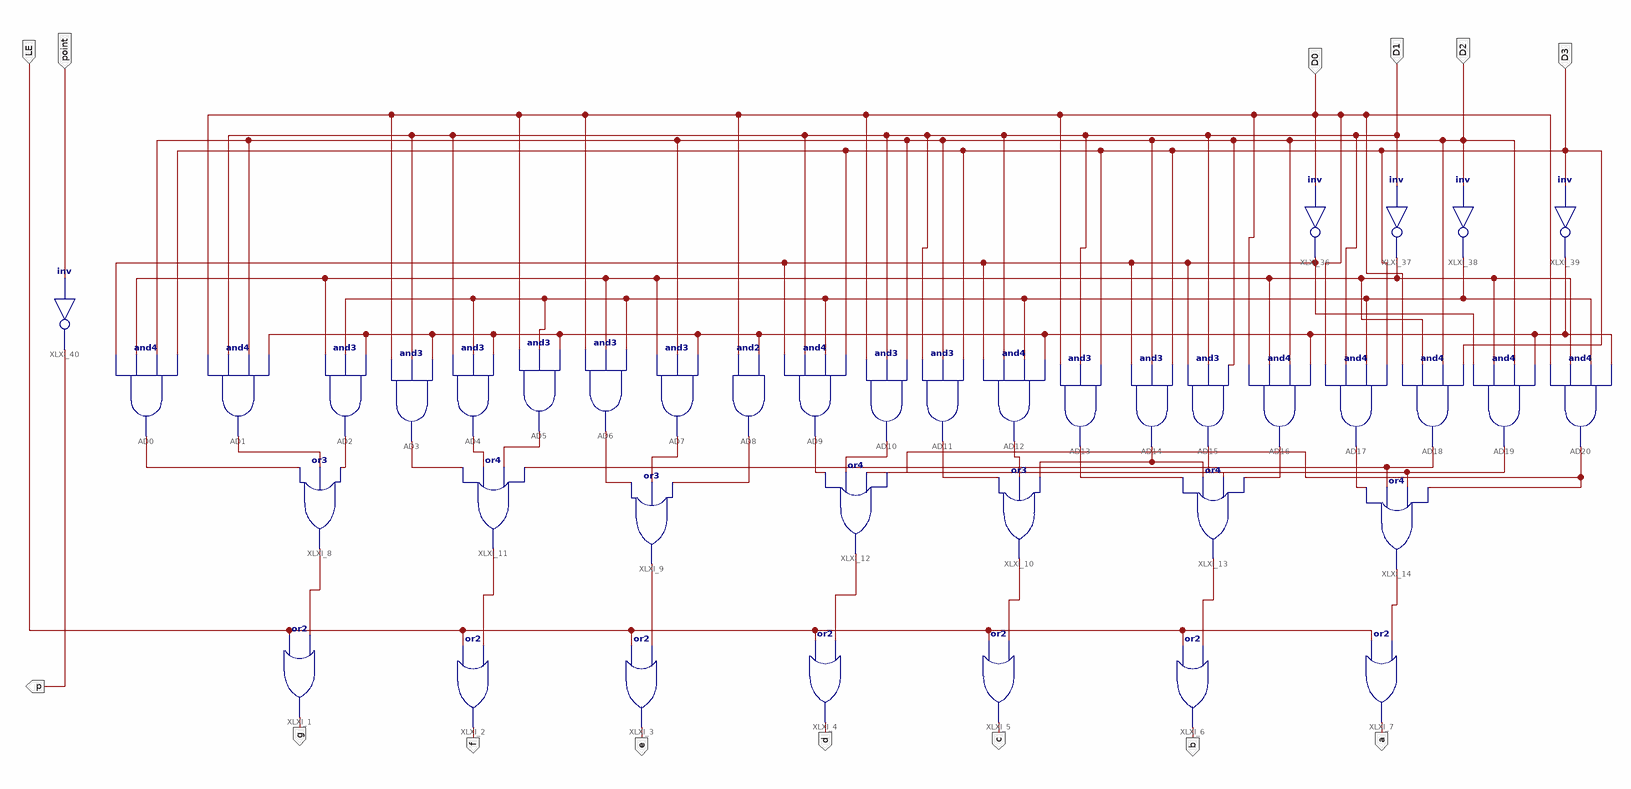
[diagram p0: schematic sheet 1]
// Xilinx ISE schematic MC14495_ZJU.sch (kintex7) as structural Verilog: 40 symbols, 14 ports
module MC14495_ZJU (
  input  D3,
  input  D0,
  input  D1,
  input  D2,
  input  LE,
  input  point,
  output p,
  output g,
  output f,
  output e,
  output d,
  output c,
  output b,
  output a
);

  wire XLXN_12, XLXN_17, XLXN_22, XLXN_25, XLXN_27, XLXN_28, XLXN_29, XLXN_30, XLXN_31, XLXN_32, XLXN_33,
       XLXN_34, XLXN_35, XLXN_36, XLXN_37, XLXN_38, XLXN_39, XLXN_40, XLXN_41, XLXN_42, XLXN_43, XLXN_45,
       XLXN_46, XLXN_47, XLXN_50, XLXN_51, XLXN_52, XLXN_53, XLXN_54, XLXN_55, XLXN_56, XLXN_57;

  or XLXI_1 (g, LE, XLXN_30);
  or XLXI_2 (f, LE, XLXN_52);
  or XLXI_3 (e, LE, XLXN_53);
  or XLXI_4 (d, LE, XLXN_54);
  or XLXI_5 (c, LE, XLXN_55);
  or XLXI_6 (b, LE, XLXN_56);
  or XLXI_7 (a, LE, XLXN_57);
  or XLXI_8 (XLXN_30, XLXN_27, XLXN_28, XLXN_29);
  or XLXI_9 (XLXN_53, XLXN_34, XLXN_35, XLXN_36);
  or XLXI_10 (XLXN_55, XLXN_39, XLXN_40, XLXN_42);
  or XLXI_11 (XLXN_52, XLXN_31, XLXN_32, XLXN_33, XLXN_47);
  or XLXI_12 (XLXN_54, XLXN_37, XLXN_38, XLXN_50, XLXN_51);
  or XLXI_13 (XLXN_56, XLXN_41, XLXN_42, XLXN_43, XLXN_45);
  or XLXI_14 (XLXN_57, XLXN_46, XLXN_47, XLXN_50, XLXN_51);
  and AD0 (XLXN_27, XLXN_12, XLXN_17, D2, D3);
  and AD1 (XLXN_28, D0, D1, D2, XLXN_25);
  and AD2 (XLXN_29, XLXN_17, XLXN_22, XLXN_25);
  and AD3 (XLXN_31, D0, D1, XLXN_25);
  and AD4 (XLXN_32, D1, XLXN_22, XLXN_25);
  and AD5 (XLXN_33, D0, XLXN_22, XLXN_25);
  and AD6 (XLXN_34, D0, XLXN_17, XLXN_22);
  and AD7 (XLXN_35, XLXN_17, D2, XLXN_25);
  and AD8 (XLXN_36, D0, XLXN_25);
  and AD9 (XLXN_37, XLXN_12, D1, XLXN_22, D3);
  and AD10 (XLXN_38, D0, D1, D2);
  and AD11 (XLXN_39, D1, D2, D3);
  and AD12 (XLXN_40, XLXN_12, D1, XLXN_22, XLXN_25);
  and AD13 (XLXN_41, D0, D1, D3);
  and AD14 (XLXN_42, XLXN_12, D2, D3);
  and AD15 (XLXN_43, XLXN_12, D1, D2);
  and AD16 (XLXN_45, D0, XLXN_17, D2, XLXN_25);
  and AD17 (XLXN_46, D0, D1, XLXN_22, D3);
  and AD18 (XLXN_47, D0, XLXN_17, D2, D3);
  and AD19 (XLXN_50, XLXN_12, XLXN_17, D2, XLXN_25);
  and AD20 (XLXN_51, D0, XLXN_17, XLXN_22, XLXN_25);
  not XLXI_36 (XLXN_12, D0);
  not XLXI_37 (XLXN_17, D1);
  not XLXI_38 (XLXN_22, D2);
  not XLXI_39 (XLXN_25, D3);
  not XLXI_40 (p, point);
endmodule
